# EAGLE design mic-amplifier (EAGLE 6.1)
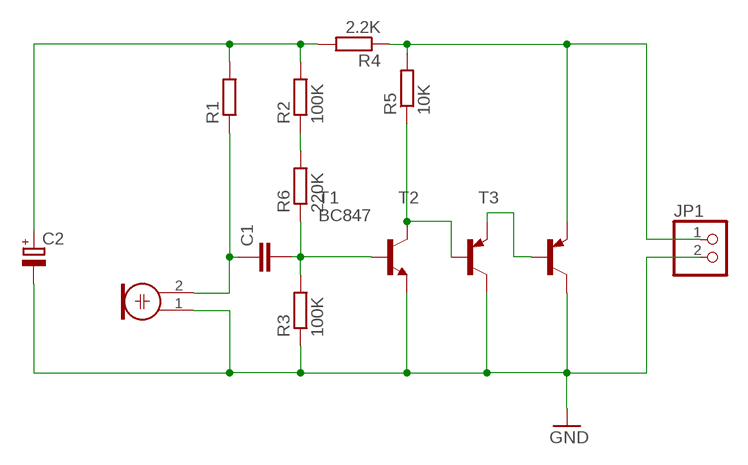
[diagram p0: schematic, sheet 1]

## Parts
C1  C-EUC1206  [C1206]
C2  CPOL-EUE2,5-6E  [E2,5-6E]
JP1  PINHD-1X2  [1X02]
M1  ELECTRET_MICROPHON-WM-61B  [WM-61B]
R1  R-EU_R0805  [R0805]
R2  100K  R-EU_R0805  [R0805]
R3  100K  R-EU_R0805  [R0805]
R4  2.2K  R-EU_R1206  [R1206]
R5  10K  R-EU_R1206  [R1206]
R6  220K  R-EU_R1206  [R1206]
T1  BC847  [SOT23]
T2  BC857B-PNP-SOT23-BEC  [SOT23-BEC]
T3  BC857B-PNP-SOT23-BEC  [SOT23-BEC]

## Nets
GND: C2.- JP1.2 M1.1 R3.1 T1.2(E) T2.C T3.C
N$1: C2.+ R1.2 R2.2 R4.2
N$2: C1.2 R3.2 R6.1 T1.1(B)
N$3: C1.1 M1.2 R1.1
N$4: R2.1 R6.2
N$5: R5.1 T1.3(C) T2.B
N$6: JP1.1 R4.1 R5.2 T3.E
N$7: T2.E T3.B

## Library data of the parts
C1 = rcl:C-EU: CAPACITOR, European symbol
C2 = rcl:CPOL-EU: POLARIZED CAPACITOR, European symbol
JP1 = pinhead:PINHD-1X2: PIN HEADER
M1 = microphon:ELECTRET_MICROPHON-: Electret Condenser Microphone
R1-R6 = rcl:R-EU_: RESISTOR, European symbol
T1 = transistor:BC847: NPN TRANSISTOR
T2 T3 = transistor:*-PNP-: PNP Transistror

## Board
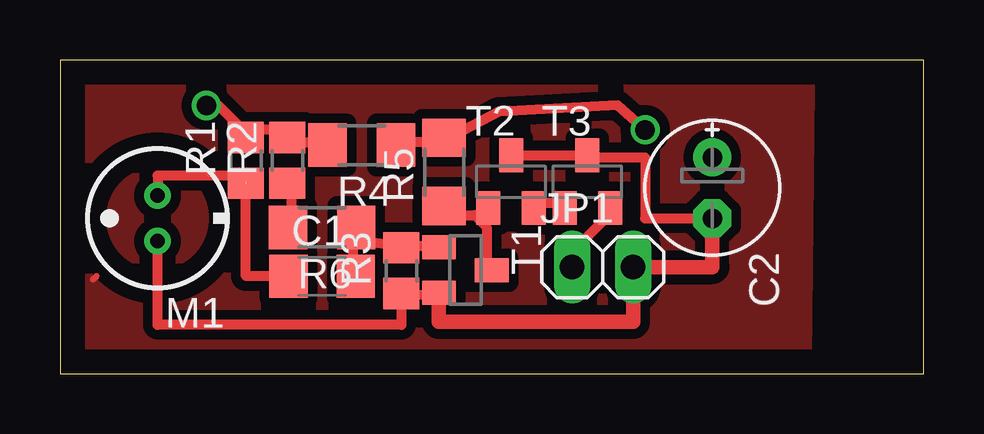
[diagram p1: board, top side]
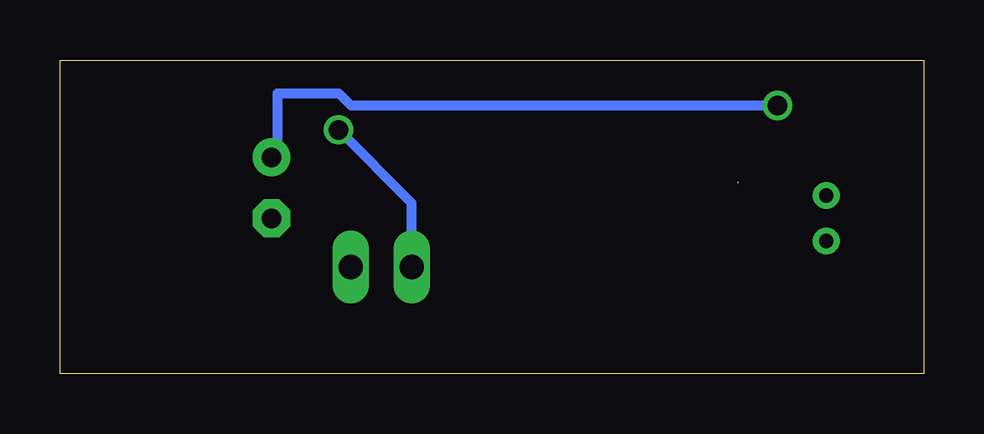
[diagram p2: board, bottom side, seen from below]

Size 35.99 x 13.07 mm. Coordinates in mm from the lower left corner, seen from the top.
Outline: 0,0 35.99,0 35.99,13.07 0,13.07 0,0
Copper layers (1*16): Top 0.035mm / dielectric 1.5mm / Bottom 0.035mm
Design rules: minimum track width 10mil, minimum drill 32mil, track to track 12mil, track to pad 12mil, pad to pad 12mil, via to via 12mil, smd to smd 8mil, copper to edge 40mil, drill to drill 40mil, minimum pad ring 10mil, minimum via ring 8mil, stop-mask expansion 4mil, vias tented up to drill 0mil, thermal gap 14mil

### Footprints (pad centres in the part's own frame; a part is rotated, then mirrored left to right if it is on the bottom)
C1206 = smd 1.6 x 1.8: 1 -1.4,0; 2 1.4,0
E2,5-6E = drill 0.813 pad 1.575: + -1.27,0 | drill 0.813 pad 1.575 octagon: - 1.27,0
1X02 = drill 1.016 long: 1 -1.27,0; 2 1.27,0
WM-61B = drill 0.6 pad 1: 1 0,0.95; 2 0,-0.95
R0805 = smd 1.3 x 1.5: 1 -0.95,0; 2 0.95,0
R1206 = smd 1.6 x 1.803: 1 -1.422,0; 2 1.422,0
SOT23 = smd 1 x 1.4: 1 -0.95,-1.1; 2 0.95,-1.1; 3 0,1.1
SOT23-BEC = smd 1 x 1.4: B -0.95,-1.1; C 0,1.1; E 0.95,-1.1

### Placement (x,y rotation side)
C1  10.92,4.06 0 top
C2  27.18,7.75 270 top
JP1  22.61,4.45 0 top
M1  4.06,6.48 180 top
R1  7.75,8.89 90 top
R2  9.47,8.89 90 top
R3  14.22,4.29 90 top
R4  12.57,9.53 180 top
R5  16,8.41 90 top
R6  10.92,6.1 180 top
T1  16.89,4.32 270 top
T2  18.8,8 0 top
T3  21.97,8 0 top

### Tracks (layer width: path | path; a pad name or v marks a point on that pad's centre or on a via)
GND
  Top 0.406: T2.C T3.C 21.97,9.02 24.38,9.02 24.38,6.48 C2.- | T1.2 15.79,3.22 R3.1 14.22,2.03 4.06,2.03 M1.1
  Top 0.61: C2.- 27.18,4.45 JP1.2 23.88,2.16 15.79,2.16 T1.2
N$1  (via drill 0.81)
  Top 0.254: 8.13,10.16 R1.2 7.62,10.16 | 9.14,10.16 R2.2 9.65,9.65 | 10.67,9.65 R4.2 | v6.1,11.18 6.6,11.18
  Top 0.406: 9.14,10.16 8.13,10.16 | 9.65,9.65 10.67,9.65 | 6.6,11.18 7.62,10.16
  Bottom 0.406: v6.1,11.18 23.88,11.18 24.38,11.68 26.92,11.68 26.92,9.14 C2.+
N$2
  Top 0.254: 15.75,5.33 T1.1 | 12.19,4.06 C1.2 | 14.22,5.33 R3.2 | 12.19,6.1 12.19,5.59 R6.1 12.19,6.1
  Top 0.406: 15.75,5.33 14.22,5.33 12.19,5.59 12.19,4.06
N$3  (1 unrouted)
  Top 0.406: C1.1 7.75,4.06 7.75,7.87 7.62,7.87 7.62,8 7.75,8 | R1.1 7.75,8.26 4.06,8.26 M1.2
N$4
  Top 0.254: 9.65,7.62 R2.1 | 9.65,6.1 R6.2
  Top 0.406: 9.65,6.1 9.65,7.62
N$5
  Top 0.254: 17.78,4.57 T1.3 | 16.26,6.6 R5.1 | 17.27,6.6 17.78,6.6 T2.B
  Top 0.406: 17.78,4.57 17.78,6.1 17.27,6.6 16.26,6.6
N$6  (via drill 0.81)
  Top 0.254: 14.22,9.65 R4.1 | 15.75,9.65 R5.2 16.38,9.91 | JP1.1 21.34,5.08 | 22.86,6.6 T3.E
  Top 0.406: 15.75,9.65 14.22,9.65 | 21.34,5.08 22.86,6.6 | 16.38,9.91 18.29,10.92 23.24,11.18 v24.38,10.16
  Bottom 0.406: v24.38,10.16 21.34,7.11 JP1.1
N$7
  Top 0.254: 19.81,7.11 T2.E | 20.83,7.11 T3.B
  Top 0.406: 20.83,7.11 19.81,7.11
N$8
  Top 0.254: 1.52,4.06 1.38,3.92
  pour Top (isolate 0.406): 0.76,11.94 31.24,11.94 31.11,0.64 0.64,0.64